# EAGLE design wifi-oil (EAGLE 6.1)
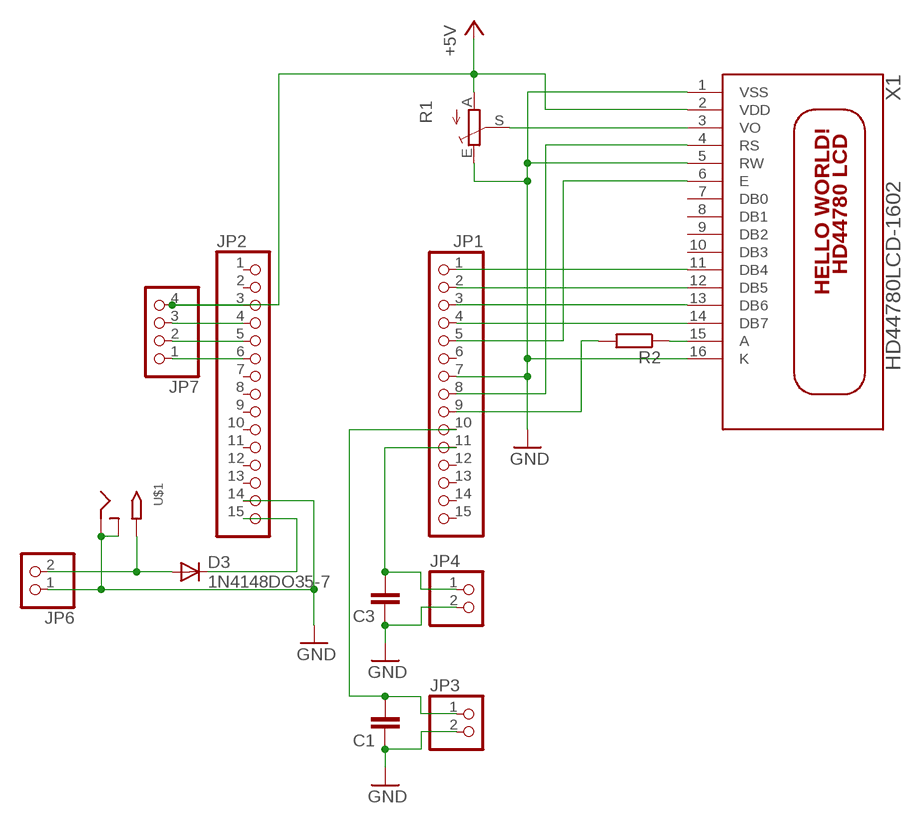
[diagram p0: schematic, sheet 1]

## Parts
C1  C-EU025-025X050  [C025-025X050]
C3  C-EU025-025X050  [C025-025X050]
D3  1N4148DO35-7  [DO35-7]
JP1  PINHD-1X15  [1X15]
JP2  PINHD-1X15  [1X15]
JP3  PINHD-1X2  [1X02]
JP4  PINHD-1X2  [1X02]
JP6  PINHD-1X2  [1X02]
JP7  PINHD-1X4  [1X04]
R1  TRIM_EU-RS3  [RS3]
R2  R-EU_0204/7  [0204/7]
U$1  2.1MMJACKTHM  [PJ-102A]
X1  HD44780LCD-1602  [LCD1602]

## Nets
GND: C1.1 C3.1 JP1.7 JP2.14 JP3.2 JP4.2 JP6.1 R1.E U$1.RING U$1.RING_SW X1.1(VSS) X1.5(RW) X1.16(K)
N$1: JP1.4 X1.14(DB7)
N$2: JP1.3 X1.13(DB6)
N$3: JP1.2 X1.12(DB5)
N$4: JP1.1 X1.11(DB4)
N$5: JP1.9 R2.2
N$6: R1.S X1.3(VO)
N$7: C1.2 JP1.10 JP3.1
N$8: JP2.6 JP7.1
N$9: JP1.8 X1.4(RS)
N$10: JP1.5 X1.6(E)
N$11: JP2.5 JP7.2
N$12: R2.1 X1.15(A)
N$13: JP2.4 JP7.3
N$14: D3.A JP6.2 U$1.TIP
N$15: C3.2 JP1.11 JP4.1
N$17: D3.C JP2.15
VDD: JP2.3 JP7.4 R1.A X1.2(VDD) ; supply symbol labelled +5V
Unconnected: JP1.6 JP1.12 JP1.13 JP1.14 JP1.15 JP2.1 JP2.2 JP2.7 JP2.8 JP2.9 JP2.10 JP2.11 JP2.12 JP2.13 X1.7(DB0) X1.8(DB1) X1.9(DB2) X1.10(DB3)

## Library data of the parts
C1 C3 = rcl:C-EU: CAPACITOR, European symbol
D3 = diode:1N4148: DIODE high speed (Philips)
JP1 JP2 = pinhead:PINHD-1X15: PIN HEADER
JP3 JP4 JP6 = pinhead:PINHD-1X2: PIN HEADER
JP7 = pinhead:PINHD-1X4: PIN HEADER
R1 = pot:TRIM_EU-: POTENTIOMETER
R2 = rcl:R-EU_: RESISTOR, European symbol
U$1 = adafruit:2.1MMJACK: 2.1mm x 5.5mm THM DC jack with internal switch. Digikey part #PJ-102A, 4UCON part #05537 2.1mm x 5.5mm SMT DC jack with internal switch. Digikey part #PJ-002A-SMT, 4UCON part #03267 By microbuilder.eu & adafruit.com
X1 = adafruit:HD44780LCD: HD44780 LCD Standard character type LCDs, available in sizes from 8x1 to 40x4!

## Board
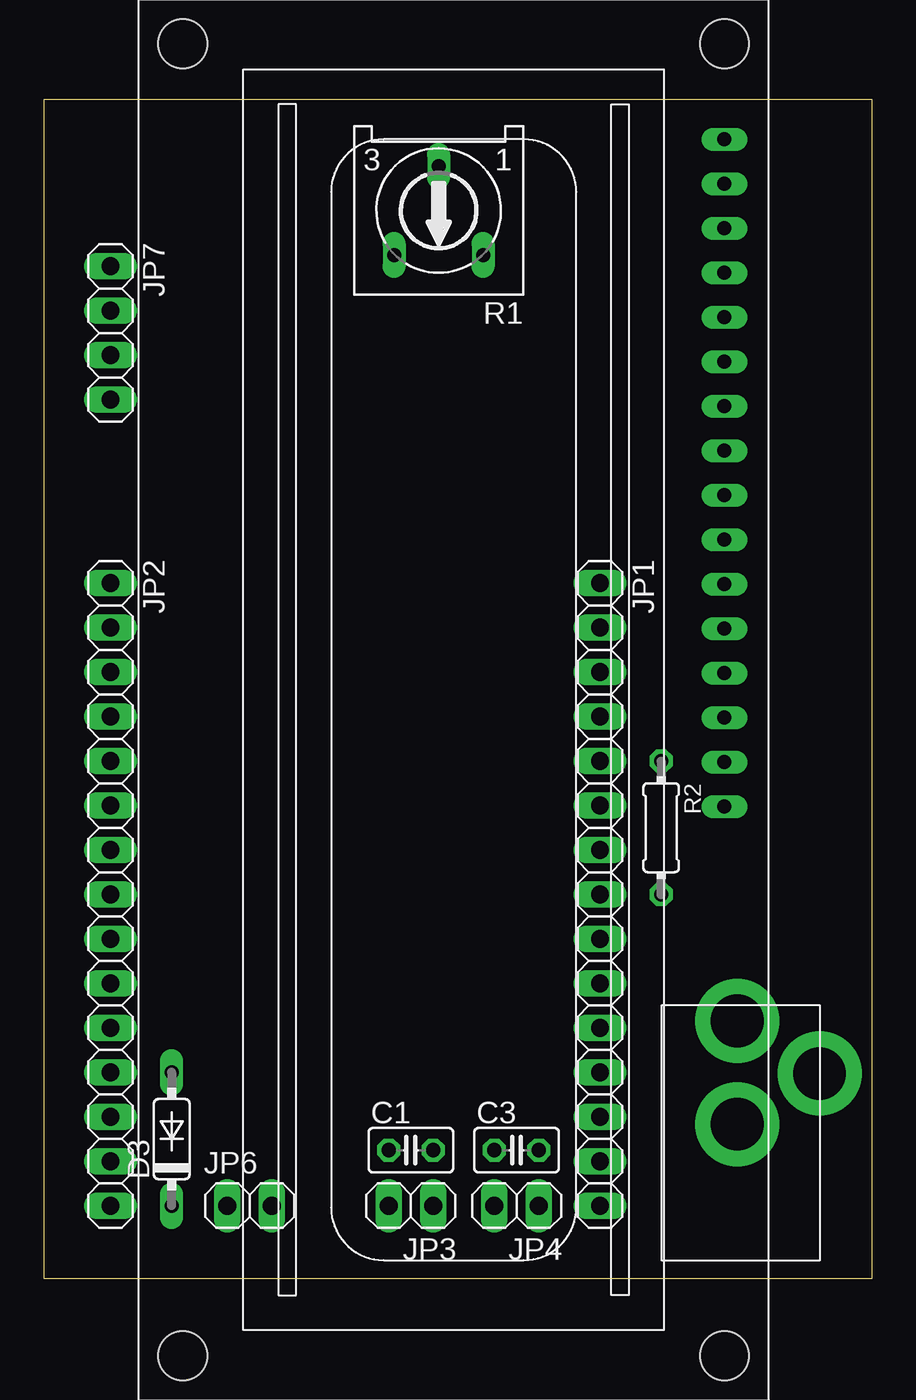
[diagram p1: board, top side]
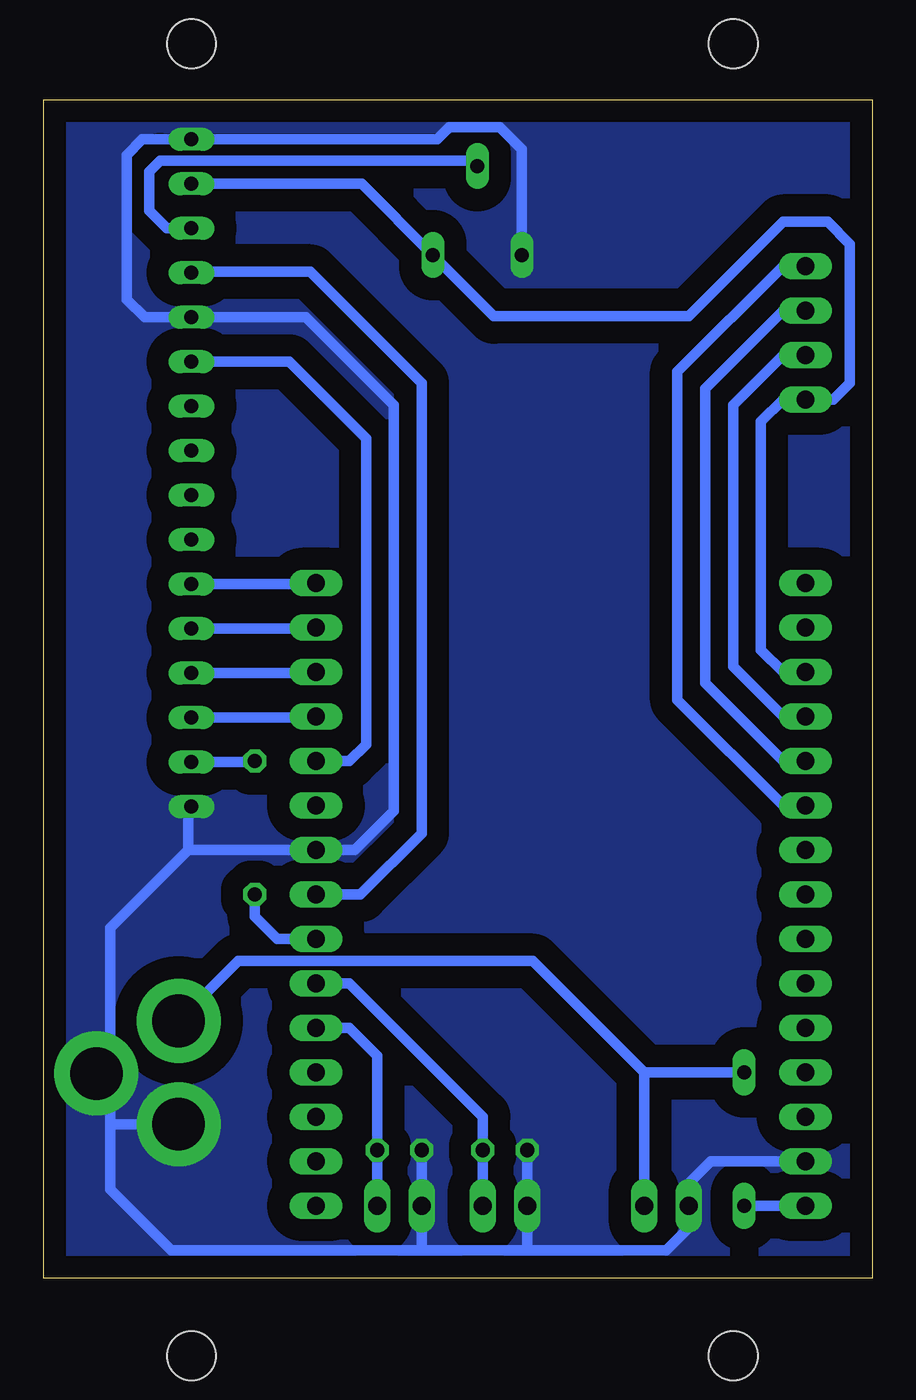
[diagram p2: board, bottom side, seen from below]

Size 47.29 x 67.3 mm. Coordinates in mm from the lower left corner, seen from the top.
Outline: 0,0 47.29,0 47.29,67.3 0,67.3 0,0
Copper layers (1*16): Top 0.035mm / dielectric 1.5mm / Bottom 0.035mm
Design rules: minimum track width 10mil, minimum drill 24mil, track to track 12mil, track to pad 12mil, pad to pad 12mil, via to via 12mil, smd to smd 10mil, copper to edge 12mil, drill to drill 12mil, minimum pad ring 10mil, minimum via ring 10mil, stop-mask expansion 4mil, vias tented up to drill 0mil, thermal gap 12mil

### Footprints (pad centres in the part's own frame; a part is rotated, then mirrored left to right if it is on the bottom)
C025-025X050 = drill 0.813 octagon: 1 -1.27,0; 2 1.27,0
DO35-7 = drill 0.813 long: A 3.81,0; C -3.81,0
1X15 = drill 1.016 long: 1 -17.78,0; 2 -15.24,0; 3 -12.7,0; 4 -10.16,0; 5 -7.62,0; 6 -5.08,0; 7 -2.54,0; 8 0,0; 9 2.54,0; 10 5.08,0; 11 7.62,0; 12 10.16,0; 13 12.7,0; 14 15.24,0; 15 17.78,0
1X02 = drill 1.016 long: 1 -1.27,0; 2 1.27,0
1X04 = drill 1.016 long: 1 -3.81,0; 2 -1.27,0; 3 1.27,0; 4 3.81,0
RS3 = drill 0.813 long: A -2.54,2.54; E 2.54,2.54; S 0,-2.54
0204/7 = drill 0.813 octagon: 1 -3.81,0; 2 3.81,0
PJ-102A = drill 3 pad 4.8: RING 0.1,-3.39; RING_SW -4.6,-6.29; TIP 0.1,-9.29
LCD1602 = drill 0.8 long: 1 8,33.46; 2 10.54,33.46; 3 13.08,33.46; 4 15.62,33.46; 5 18.16,33.46; 6 20.7,33.46; 7 23.24,33.46; 8 25.78,33.46; 9 28.32,33.46; 10 30.86,33.46; 11 33.4,33.46; 12 35.94,33.46; 13 38.48,33.46; 14 41.02,33.46; 15 43.56,33.46; 16 46.1,33.46 | hole 2.8: 2.54,2.54; 2.54,33.46; 77.46,33.46; 77.46,2.54

### Placement (x,y rotation side)
C1  20.95,7.3 0 top
C3  26.99,7.3 0 top
D3  7.3,7.94 90 top
JP1  31.75,21.91 270 top
JP2  3.81,21.91 270 top
JP3  20.95,4.13 180 top
JP4  26.99,4.13 180 top
JP6  11.75,4.13 0 top
JP7  3.81,53.98 270 top
R1  22.54,60.96 180 top
R2  35.24,25.72 270 top
U$1  39.69,5.4 180 top
X1  5.4,73.03 270 top

### Tracks (layer width: path | path; a pad name or v marks a point on that pad's centre or on a via)
GND
  Bottom 0.61: 39.05,24.45 JP1.7 29.53,24.45 27.3,26.67 27.3,49.85 32.32,54.87 X1.5 41.53,54.87 42.55,55.88 42.55,64.14 41.66,65.03 X1.1 24.83,65.03 24.13,65.72 21.27,65.72 20,64.45 R1.E | 39.05,24.45 39.05,26.73 X1.16 | 25.72,1.59 40.01,1.59 43.5,5.08 43.5,8.89 | C3.1 JP4.2 25.72,1.59 | C1.1 JP3.2 | 19.68,2.86 JP3.2 | JP2.14 9.21,6.67 10.48,5.4 JP6.1 10.48,2.86 11.75,1.59 19.68,1.59 | 19.68,1.59 25.72,1.59 | 19.68,1.59 JP3.2 | 43.5,8.89 43.5,11.75 | 43.5,11.75 43.5,20 39.05,24.45 | U$1.RING_SW 43.56,11.69 43.5,11.75 | U$1.RING 43.4,8.79 43.5,8.89
  pour Bottom (isolate 1.27, no thermals): 0,0 47.31,0 47.31,67.31 0,67.31
N$1
  Bottom 0.61: X1.14 31.75,32.01 JP1.4
N$2
  Bottom 0.61: X1.13 31.75,34.55 JP1.3
N$3
  Bottom 0.61: X1.12 31.75,37.09 JP1.2
N$4
  Bottom 0.61: X1.11 31.75,39.62 JP1.1
N$5
  Bottom 0.61: JP1.9 33.97,19.37 35.24,20.64 R2.2
N$6
  Bottom 0.61: X1.3 40.26,59.95 41.27,60.96 41.27,63.18 40.64,63.82 22.86,63.82 R1.S
N$7
  Bottom 0.61: JP3.1 C1.2 22.23,9.21 29.84,16.83 JP1.10
N$8
  Bottom 0.61: JP2.6 5.08,26.99 11.11,33.02 11.11,51.75 5.08,57.78 JP7.1
N$9
  Bottom 0.61: JP1.8 29.21,21.91 25.72,25.4 25.72,51.12 32.07,57.47 38.8,57.47 X1.4
N$10
  Bottom 0.61: X1.6 33.27,52.33 28.89,47.94 28.89,30.48 29.84,29.53 JP1.5
N$11
  Bottom 0.61: JP2.5 5.08,29.53 9.53,33.97 9.53,50.8 5.08,55.24 JP7.2
N$12
  Bottom 0.61: X1.15 35.3,29.46 R2.1
N$13
  Bottom 0.61: JP2.4 5.08,32.07 7.94,34.92 7.94,49.85 5.08,52.7 JP7.3
N$14
  Bottom 0.61: JP6.2 13.02,11.75 | D3.A 13.02,11.75 | 13.02,11.75 19.37,18.1 36.18,18.1 U$1.TIP
N$15
  Bottom 0.61: JP4.1 C3.2 28.26,12.7 29.84,14.29 JP1.11
N$17
  Bottom 0.61: JP2.15 D3.C
VDD
  Bottom 0.61: X1.2 29.15,62.48 R1.A 21.59,54.93 10.48,54.93 5.08,60.33 2.54,60.33 1.27,59.05 1.27,51.12 2.22,50.16 JP7.4 5.08,50.16 6.35,48.9 6.35,35.88 5.08,34.61 JP2.3